# EAGLE design generator_cd4047 (EAGLE 7.2.0)
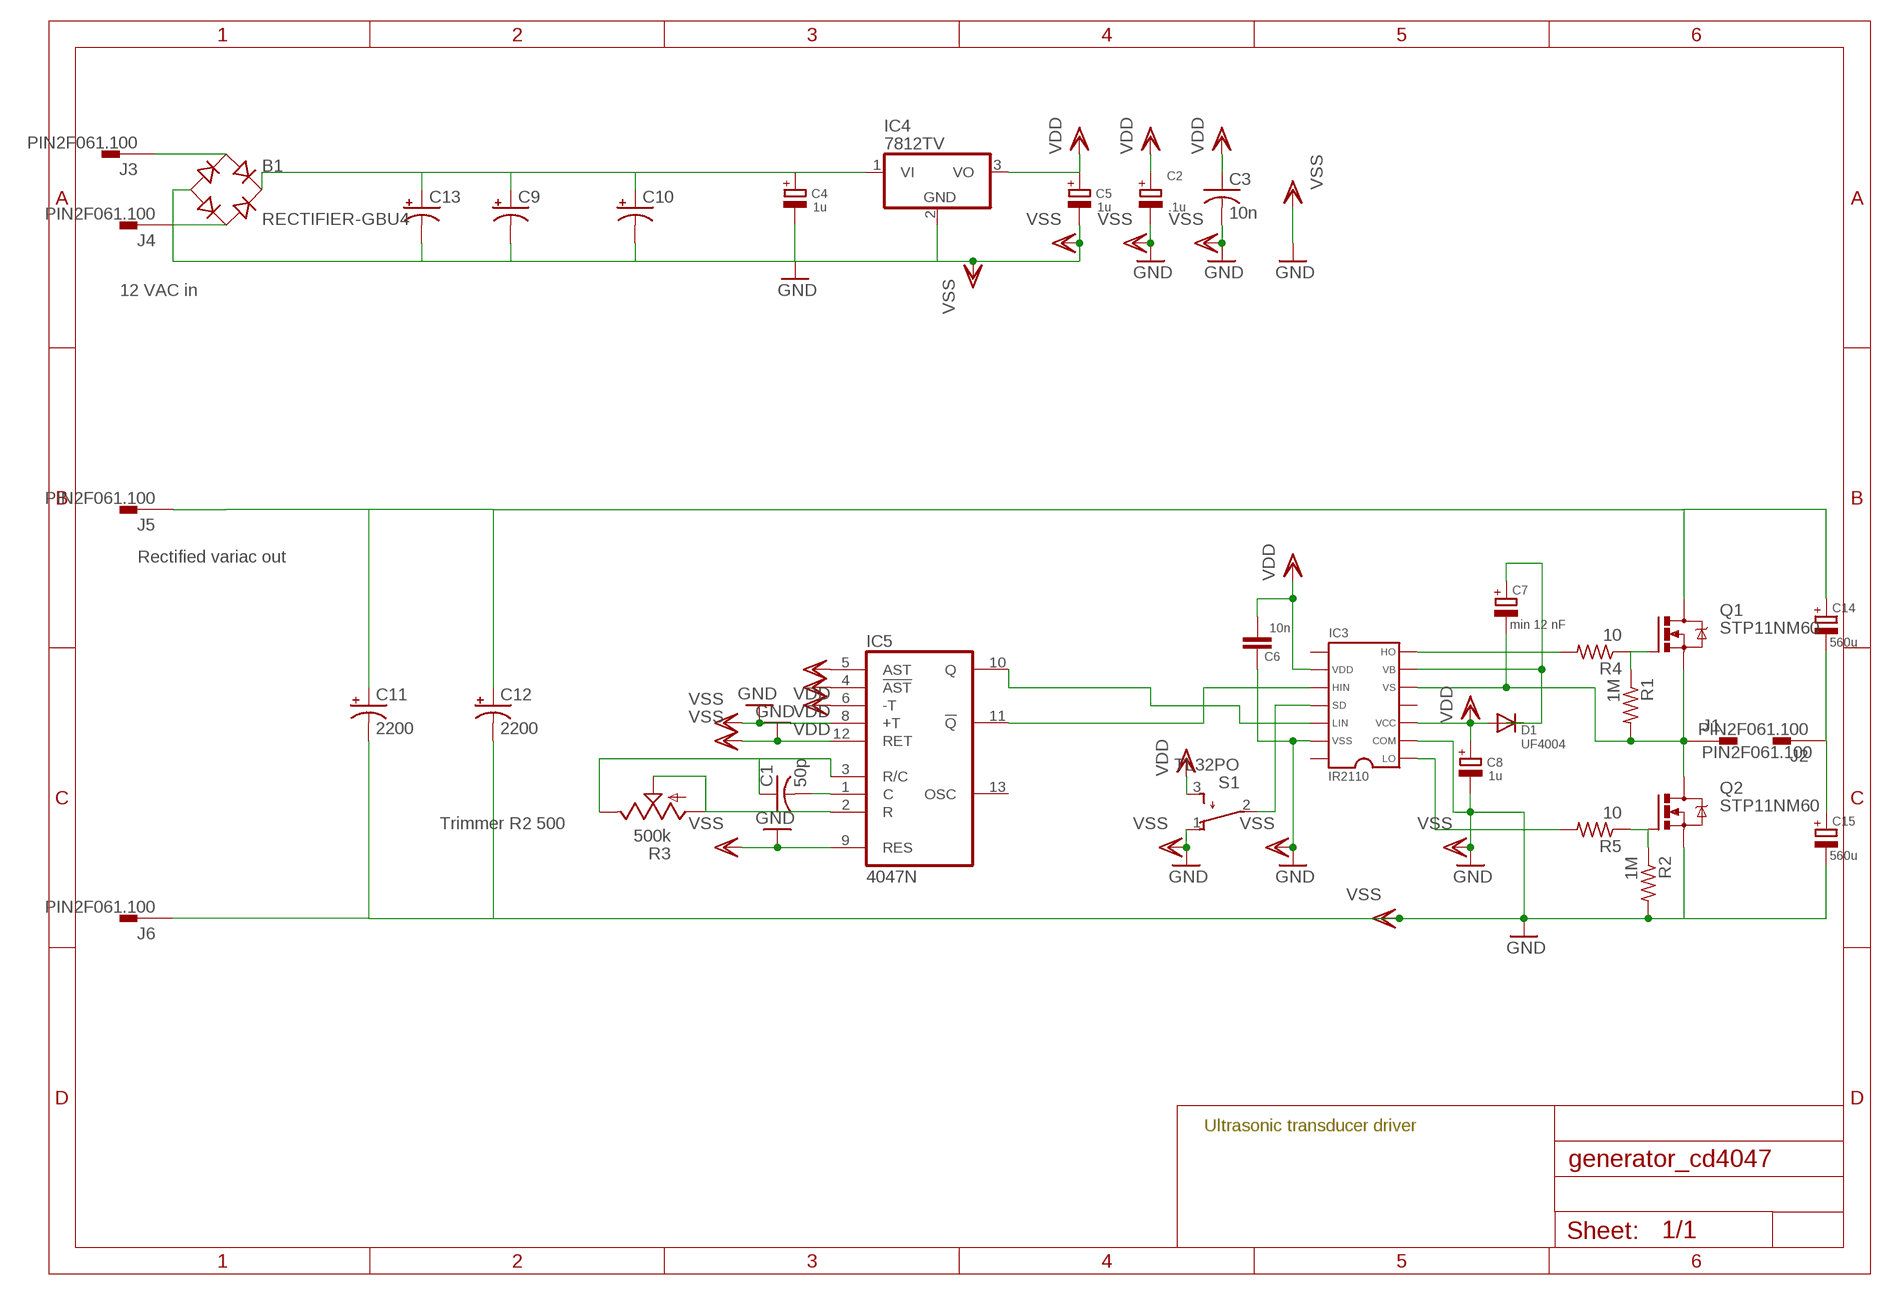
[diagram p0: schematic, sheet 1]

## Parts
B1  RECTIFIER-GBU4  [GBU4]
C1  50p  C-US075-042X103  [C075-042X103]
C2  .1u  CPOL-EUE5-8.5  [E5-8,5]
C3  10n  C-US075-042X103  [C075-042X103]
C4  1u  CPOL-EUE5-8.5  [E5-8,5]
C5  1u  CPOL-EUE5-8.5  [E5-8,5]
C6  10n  C-EU075-052X106  [C075-052X106]
C7  min 12 nF  CPOL-EUE5-8.5  [E5-8,5]
C8  1u  CPOL-EUE5-8.5  [E5-8,5]
C9  CPOL-USE7.5-18  [E7,5-18]
C10  CPOL-USE7.5-18  [E7,5-18]
C11  2200  CPOL-USE10-35  [EB35D]
C12  2200  CPOL-USE10-35  [EB35D]
C13  CPOL-USE7.5-18  [E7,5-18]
C14  560u  CPOL-EUE7.5-16  [E7,5-16]
C15  560u  CPOL-EUE7.5-16  [E7,5-16]
D1  UF4004  DIODE-D-7.5  [D-7.5]
IC3  IR2110  [DIL14]
IC4  7812TV  [TO220V]
IC5  4047N  [DIL14]
J1  PIN2F061.100  [F061.100]
J2  PIN2F061.100  [F061.100]
J3  PIN2F061.100  [F061.100]
J4  PIN2F061.100  [F061.100]
J5  PIN2F061.100  [F061.100]
J6  PIN2F061.100  [F061.100]
Q1  STP11NM60  IRF530  [TO220BV]
Q2  STP11NM60  IRF530  [TO220BV]
R1  1M  R-US_0207/10  [0207/10]
R2  1M  R-US_0207/10  [0207/10]
R3  500k  TRIM_US-RJ9W  [RJ9W]
R4  10  R-US_0207/10  [0207/10]
R5  10  R-US_0207/15  [0207/15]
S1  TL32PO  [TL3XPO]

## Nets
HO: IC3.7 R4.2
LO: IC3.1 R5.2
N$1: C7.+ D1.C IC3.6
N$2: IC5.2(R) R3.A R3.S
N$3: C1.1 IC5.3(R/C) R3.E
N$4: C1.2 IC5.1(C)
N$5: IC3.12 IC5.10(Q)
N$6: C11.+ C12.+ C14.+ J5.A1 J5.A2 Q1.D
N$7: B1.+ C4.+ C9.+ C10.+ C13.+ IC4.1(VI)
N$8: C14.- C15.+ J2.A1 J2.A2
N$9: B1.AC2 J4.A1 J4.A2
N$10: B1.AC1 J3.A1 J3.A2
N$11: Q2.G R2.1 R5.1
N$12: Q1.G R1.1 R4.1
N$14: IC3.10 IC5.11(!Q)
N$17: IC3.11 S1.2(P)
TRANS: C7.- IC3.5 J1.A1 J1.A2 Q1.S Q2.D R1.2
VDD: C2.+ C3.1 C5.+ C6.2 C8.+ D1.A IC3.3 IC3.9 IC4.3(VO) IC5.4(!AST) IC5.5(AST) IC5.6(-T) S1.3(S)
VSS: B1.- C2.- C3.2 C4.- C5.- C6.1 C8.- C9.- C10.- C11.- C12.- C13.- C15.- IC3.2 IC3.13 IC4.2(GND) IC5.8(+T) IC5.9(RES) IC5.12(RET) J6.A1 J6.A2 Q2.S R2.2 S1.1(O) ; supply symbol labelled GND
Unconnected: IC3.4 IC3.8 IC3.14 IC5.13(OSC)

## Notes on the sheet
- 12 VAC in
- Rectified variac out
- Trimmer R2 500
- Ultrasonic transducer driver

## Power pins joined to a net without a drawn wire
VDD: IC5.14(VDD)
VSS: IC5.7(VSS)

## Library data of the parts
B1 = rectifier:RECTIFIER-: Rectifier
C1 C3 = rcl:C-US: CAPACITOR, American symbol
C2 C4 C5 C7 C8 C14 C15 = rcl:CPOL-EU: POLARIZED CAPACITOR, European symbol
C6 = rcl:C-EU: CAPACITOR, European symbol
C9-C13 = resistor:CPOL-US: POLARIZED CAPACITOR, American symbol
D1 = diode:DIODE-: DIODE
IC3 = lindsay-mosfet-driver:IR2110
IC4 = linear:78*: Positive VOLTAGE REGULATOR Source: http://cache.national.com/ds/LM/LM78L05.pdf http://www.fairchildsemi.com/ds/LM/LM7805.pdf
IC5 = 40xx:4047: LP monostable/astable MULTIVIBRATOR
J1-J6 = con-faston:PIN2: Flachstecker Typ Tyco/Electronics/AMP TAB, FASTON Printed Circuit Board Tabs Source: http://www.buerklin.com, http://catalog.tycoelectronics.com; OC_FARNELL: unknown; OC_NEWARK: unknown
Q1 Q2 = transistor-power:IRF530: HEXFET Power MOSFET
R1 R2 R4 R5 = rcl:R-US_: RESISTOR, American symbol
R3 = pot:TRIM_US-: POTENTIOMETER
S1 = switch:TL32PO: TINY SWITCH ON - MOM Source: http://www2.produktinfo.conrad.com/datenblaetter/700000-724999/705152-da-01-de-Subminiaturschalter_TL_36YO.pdf

## Board
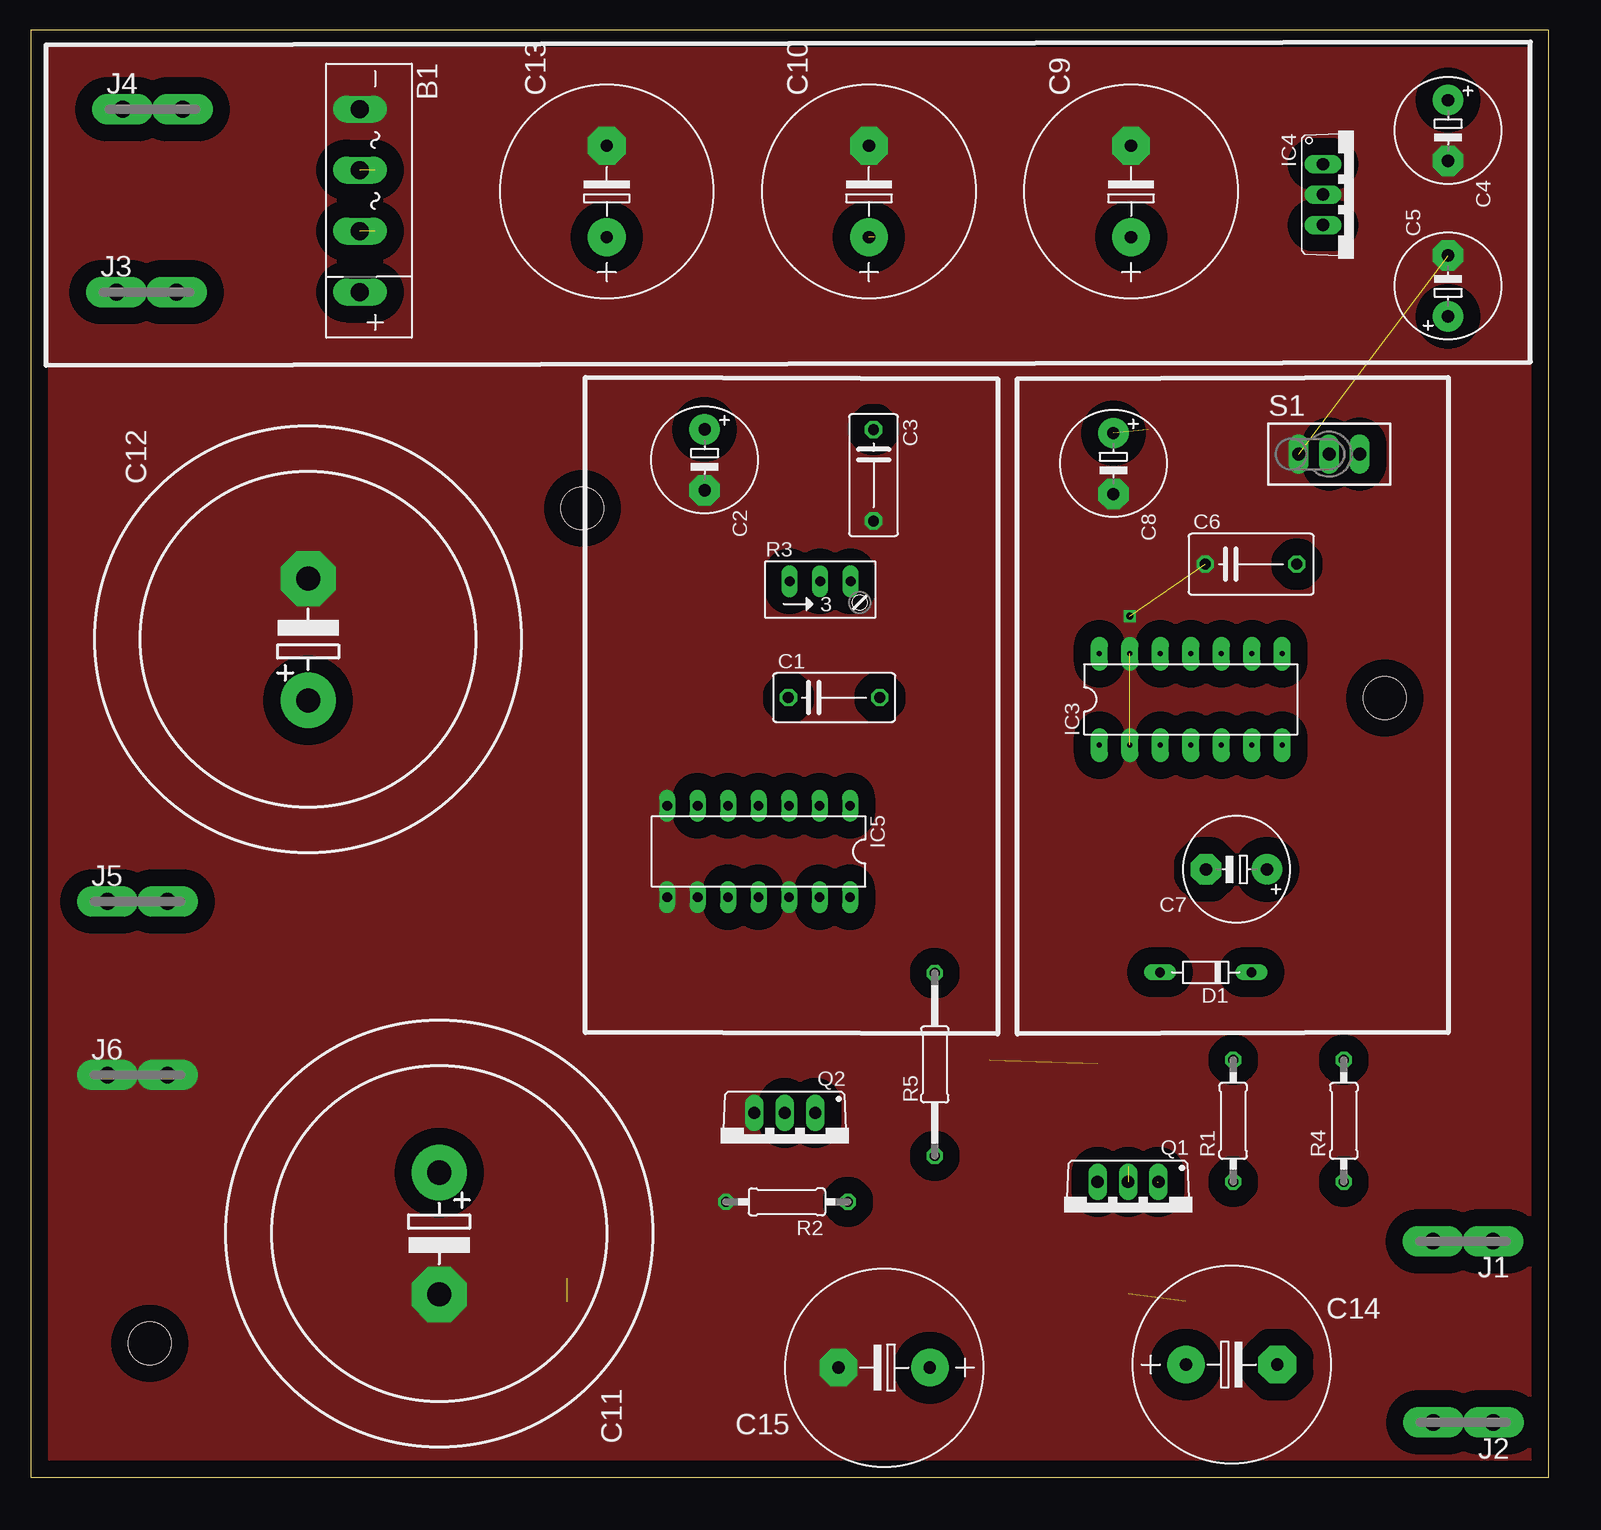
[diagram p1: board, top side]
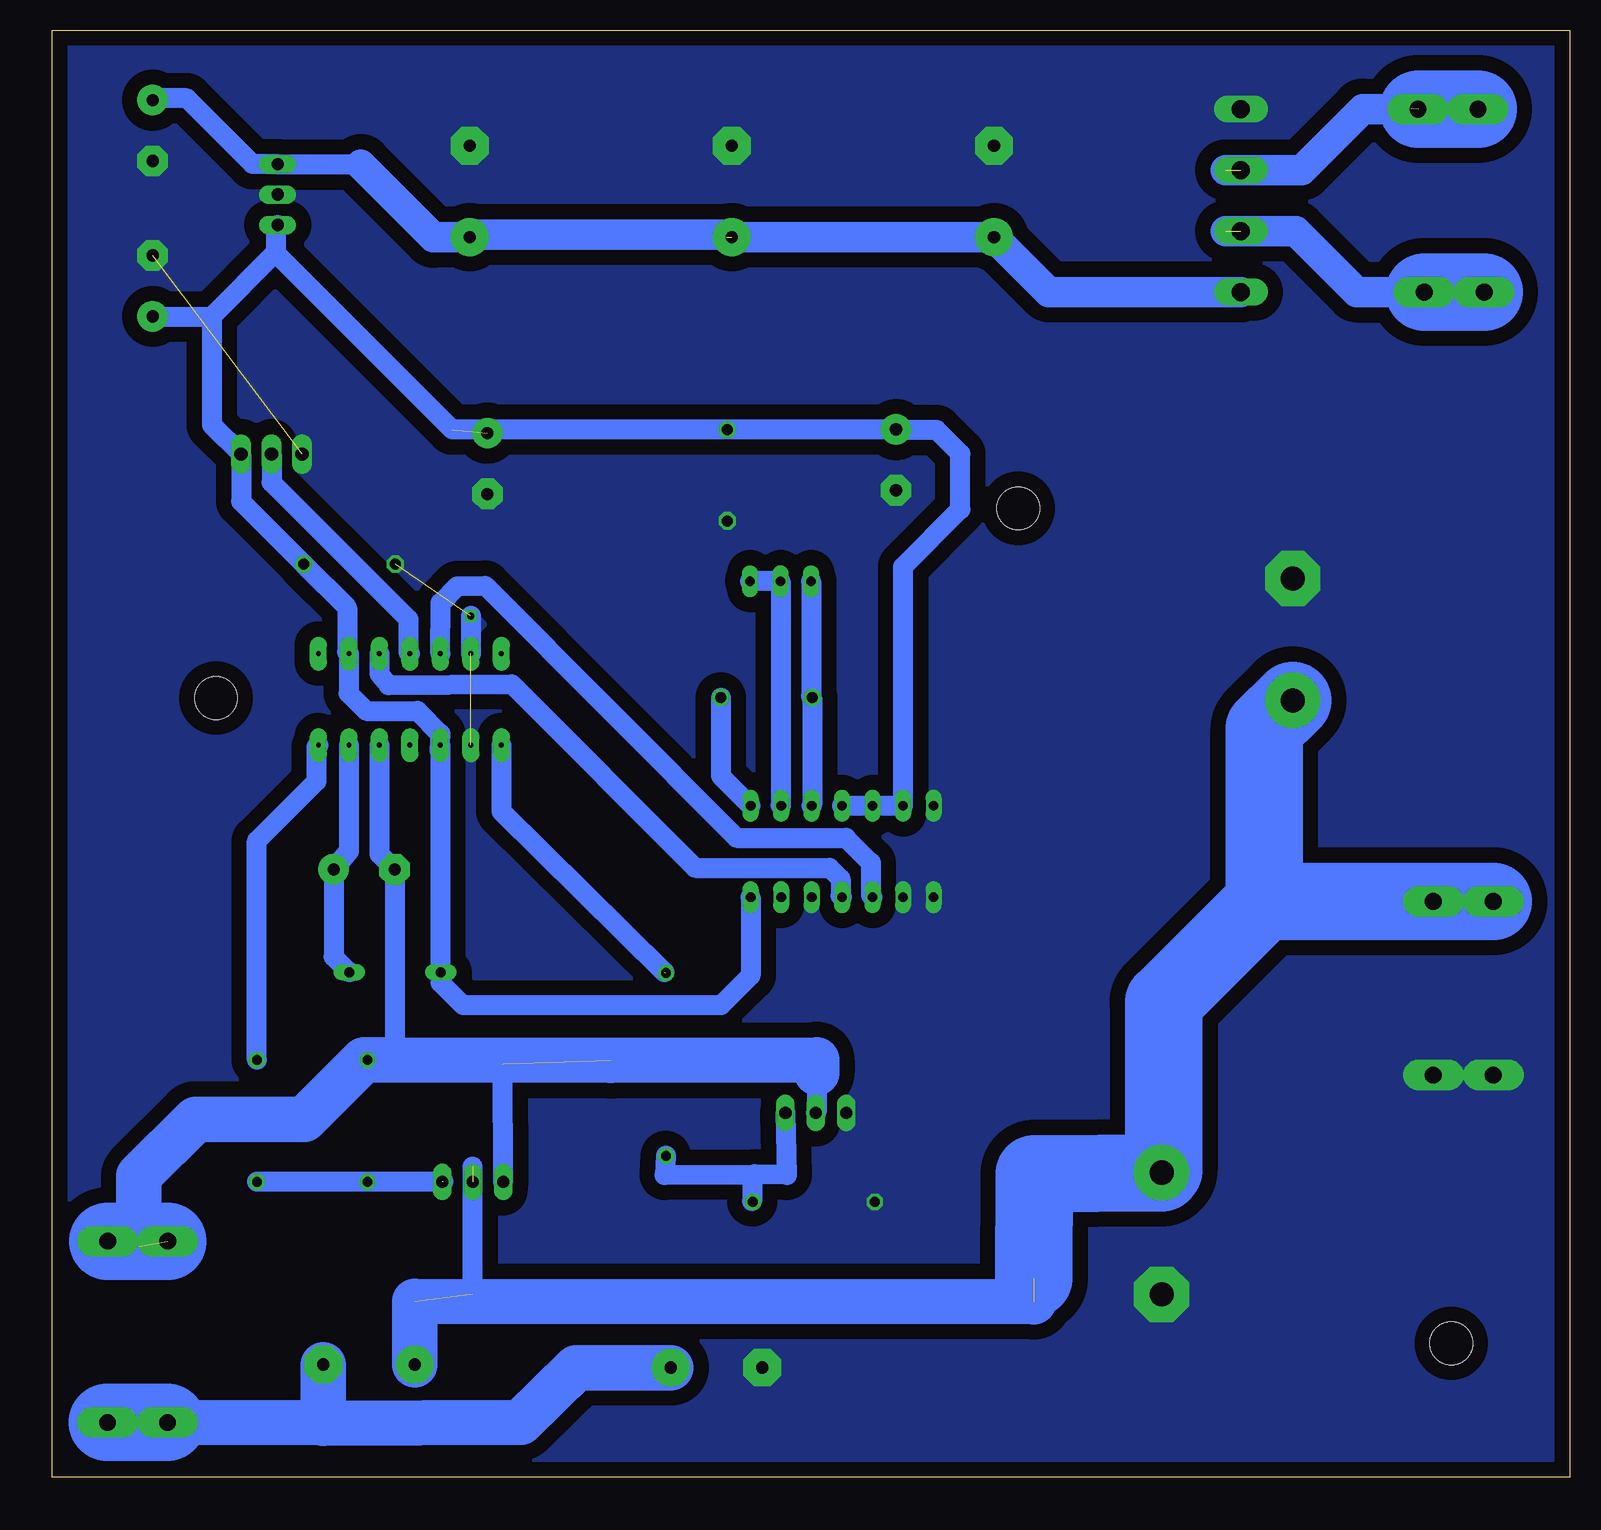
[diagram p2: board, bottom side, seen from below]

Size 126.49 x 120.65 mm. Coordinates in mm from the lower left corner, seen from the top.
Outline: 0,0 126.49,0 126.49,120.65 0,120.65 0,0
Copper layers (1*16): Top 0.035mm / dielectric 1.5mm / Bottom 0.035mm
Design rules "default *": minimum track width 10mil, minimum drill 24mil, track to track 8mil, track to pad 8mil, pad to pad 8mil, via to via 8mil, smd to smd 8mil, copper to edge 5mil, drill to drill 8mil, minimum pad ring 10mil, minimum via ring 8mil, stop-mask expansion 4mil, vias tented up to drill 0mil, thermal gap 10mil
Holes 3.56 mm at 9.91,11.18 45.97,80.77 112.83,64.97

### Footprints (pad centres in the part's own frame; a part is rotated, then mirrored left to right if it is on the bottom)
GBU4 = drill 1.499 long: + 7.62,0; - -7.62,0; AC1 2.54,0; AC2 -2.54,0
C075-042X103 = drill 0.914 octagon: 1 -3.81,0; 2 3.81,0
E5-8,5 = drill 1.016 pad 2.54: + -2.54,0 | drill 1.016 pad 2.54 octagon: - 2.54,0
C075-052X106 = drill 0.914 octagon: 1 -3.81,0; 2 3.81,0
E7,5-18 = drill 1.016 pad 3.15: + -3.81,0 | drill 1.016 pad 3.15 octagon: - 3.81,0
EB35D = drill 2.007 pad 4.597: + -5.08,0 | drill 2.007 pad 4.597 octagon: - 5.08,0
E7,5-16 = drill 1.016 pad 3.15: + -3.81,0 | drill 1.016 pad 3.15 octagon: - 3.81,0
D-7.5 = drill 0.813 long: A 3.81,0; C -3.81,0
DIL14 = drill 0.406 pad 1.422 long: 1 -7.62,-3.81; 2 -5.08,-3.81; 3 -2.54,-3.81; 4 0,-3.81; 5 2.54,-3.81; 6 5.08,-3.81; 7 7.62,-3.81; 8 7.62,3.81; 9 5.08,3.81; 10 2.54,3.81; 11 0,3.81; 12 -2.54,3.81; 13 -5.08,3.81; 14 -7.62,3.81
TO220V = drill 1.016 long: 1 -2.54,-2.54; 2 0,-2.54; 3 2.54,-2.54
DIL14' = drill 0.813 long: 1 -7.62,-3.81; 2 -5.08,-3.81; 3 -2.54,-3.81; 4 0,-3.81; 5 2.54,-3.81; 6 5.08,-3.81; 7 7.62,-3.81; 8 7.62,3.81; 9 5.08,3.81; 10 2.54,3.81; 11 0,3.81; 12 -2.54,3.81; 13 -5.08,3.81; 14 -7.62,3.81
F061.100 = drill 1.4 pad 2.54 long: A1 -2.5,0; A2 2.5,0
TO220BV = drill 1.016 long: D 0,-2.54; G -2.54,-2.54; S 2.54,-2.54
0207/10 = drill 0.813 octagon: 1 -5.08,0; 2 5.08,0
RJ9W = drill 0.813 long: A 2.54,0.635; E -2.54,0.635; S 0,0.635
0207/15 = drill 0.813 octagon: 1 -7.62,0; 2 7.62,0
TL3XPO = drill 1.1 pad 1.422 long: 1 -2.54,0; 2 0,0; 3 2.54,0

### Placement (x,y rotation side)
B1  27.43,106.43 270 top
C1  66.95,65 0 top
C2  56.16,84.81 270 top
C3  70.23,83.54 270 top
C4  118.11,112.27 270 top
C5  118.11,99.31 90 top
C6  101.7,76.12 0 top
C7  100.48,50.67 180 top
C8  90.22,84.51 270 top
C9  91.69,107.19 90 top
C10  69.85,107.19 90 top
C11  34.04,20.32 270 top
C12  23.11,69.85 90 top
C13  48.01,107.19 90 top
C14  100.08,9.4 0 top
C15  71.12,9.14 180 top
D1  97.92,42.09 180 top
IC3  96.67,64.85 0 top
IC4  110.24,106.93 270 top
IC5  4047N  [DIL14']  60.66,52.17 180 top
J1  119.35,19.69 180 top
J2  119.38,4.57 180 top
J3  9.65,98.81 0 top
J4  10.16,114.05 0 top
J5  8.89,48.01 0 top
J6  8.89,33.53 0 top
Q1  91.44,22.1 180 top
Q2  62.84,27.84 180 top
R1  100.2,29.72 90 top
R2  63.02,22.96 180 top
R3  65.79,74.07 0 top
R4  109.42,29.72 90 top
R5  75.34,34.42 90 top
S1  108.2,85.29 0 top

### Tracks (layer width: path | path; a pad name or v marks a point on that pad's centre or on a via)
HO
  Bottom 1.676: R4.2 109.42,53.06 104.44,58.04 104.44,60.88 IC3.7
LO  (1 unrouted)
  Bottom 1.676: IC3.1 89.05,55.52 75.46,42.09
N$1
  Bottom 1.676: IC3.6 101.75,52.2 C7.+ 103.02,43.38 D1.C
N$2
  Bottom 1.676: IC5.2 65.79,56.03 R3.S R3.A
N$3
  Bottom 1.676: R3.E 63.25,65.1 C1.1 63.14,56.03 IC5.3
N$4
  Bottom 1.676: C1.2 70.76,58.47 IC5.1
N$5
  Bottom 1.676: IC3.12 94.11,72.9 92.71,74.3 90.4,74.32 69.44,53.31 60.35,53.31 58.27,51.23 58.27,48.51 IC5.10
N$6  (3 unrouted)
  Bottom 1.676: 91.44,15.29 91.44,25.91
  Bottom 3.81: C14.+ 96.27,14.66 44.68,14.63
  Bottom 6.452: 44.68,16.59 44.63,25.3 C11.+ 33.86,25.58 33.86,39.62 25.48,48.01 | J5.A1 J5.A2 25.48,48.01 | 25.48,48.01 25.48,62.41 C12.+
N$7  (1 unrouted)
  Bottom 1.676: 100.76,109.42 107.65,109.42 IC4.1 109.78,109.47 115.27,114.96 117.96,114.96 C4.+
  Bottom 2.54: B1.+ 43.43,98.81 C13.+ 70.31,103.38 70.51,103.58 91.49,103.58 C9.+ 94.72,103.38 100.76,109.42
N$8
  Bottom 3.81: C15.+ 82.83,9.14 87.45,4.57 103.91,4.5 C14.- 103.91,4.55 J2.A2
  Bottom 6.452: J2.A2 J2.A1
N$9  (2 unrouted)
  Bottom 2.54: 28.7,108.97 22.35,108.97 17.27,114.05 13.26,114.05 13.21,114.1
  Bottom 6.452: J4.A1 J4.A2
N$10  (1 unrouted)
  Bottom 2.54: 28.7,103.89 22.86,103.89 17.78,98.81 J3.A2
  Bottom 6.452: J3.A1 J3.A2
N$11
  Bottom 1.422: 68.15,23.01 R2.1
  Bottom 1.676: Q2.G 65.25,25.2 67.96,25.26 | 67.96,25.26 68.15,25.07 68.15,23.01 | R5.1 75.44,25.2 67.96,25.26
N$12  (1 unrouted)
  Bottom 1.676: 93.88,24.64 R1.1 R4.1
N$14
  Bottom 1.676: IC3.10 99.21,66.98 98.45,66.04 88.19,66.12 72.9,50.8 61.7,50.8 60.78,49.89 60.78,48.49 IC5.11
N$17
  Bottom 1.676: S1.2 108.2,82.93 96.8,71.53 96.8,68.78 IC3.11
TRANS  (2 unrouted)
  Bottom 1.676: Q1.S 88.93,34.44 | 62.79,33.73 62.79,30.43 Q2.D | IC3.5 99.21,51.94 C7.- 97.94,34.79
  Bottom 3.81: 62.79,33.73 62.79,34.8 79.93,34.75 97.94,34.79 R1.2 100.53,34.8 105.49,29.85 114.53,29.85 119.25,25.12 119.25,19.25 119.38,19.13
  Bottom 6.452: J1.A2 J1.A1
VDD  (1 unrouted)
  Bottom 1.676: C5.+ 113.18,96.77 | 113.18,96.77 107.87,102.08 | 107.87,102.08 107.8,102.16 107.8,104.29 IC4.3 | 107.87,102.08 93.14,87.35 C3.1 C2.+ 56.11,87.3 52.78,87.3 50.8,85.32 50.8,80.7 55.58,75.92 IC5.6 IC5.5 IC5.4 | 113.18,96.77 113.18,87.73 S1.3 110.74,81.36 C6.2 105.51,76.1 101.91,72.49 101.91,68.81 IC3.9 101.78,65.35 100.31,63.88 96.04,63.88 94.13,61.98 94.21,60.58 94.13,60.5 | IC3.3 94.13,60.5 | 94.13,60.5 94.13,42.11 D1.A 94.11,41.22 92.23,39.34 70.76,39.34 68.28,41.83 IC5.14
VSS  (via drill 0.6)  (3 unrouted)
  Bottom 1.676: v91.59,71.81 IC3.13
  pour Bottom (isolate 1.27, no thermals): 0.03,120.7 126.39,120.7 126.39,0 0.03,0
  pour Top (isolate 1.422, no thermals): -0.05,120.68 126.57,120.68 126.57,-0.05 -0.05,-0.05